# Altium schematic sheet TIDA-010967_Decoupling_caps.SchDoc: DECOUPLING_CAPS
size 431 x 279 mm; Date: Not shown in title block; ApprovedBy: Not shown in title block; CheckedBy: Not shown in title block; Author: Not shown in title block; CompanyName: Not shown in title block; DrawnBy: Justin Yin; Engineer: Not shown in title block; Organization: Not shown in title block; Address1: Not shown in title block; Address2: Not shown in title block; Address3: Not shown in title block; Address4: Not shown in title block; DocumentNumber: 6; Revision: Use project parameter SCH_Rev; SheetNumber: 6; SheetTotal: 8; PageSetup: Record=PageOptions|CenterHorizontal=True|CenterVertical=True|PrintScale=1.00|XCorrection=1.00|YCorrection=1.00|PrintKind=0|BorderSize=5000000|LeftOffset=0|BottomOffset=0|Orientation=2|PaperLength=1000|PaperWidth=1000|Scale=100|PaperSource=15|PrintQuality=600|MediaType=1|DitherType=10|PaperKind=Letter|PrintScaleMode=1; CurrentTime: Not shown in title block; CurrentDate: Not shown in title block; Time: Not shown in title block; DocumentFullPathAndName: Not shown in title block; DocumentName: Not shown in title block; ModifiedDate: Not shown in title block; ImagePath: Not shown in title block
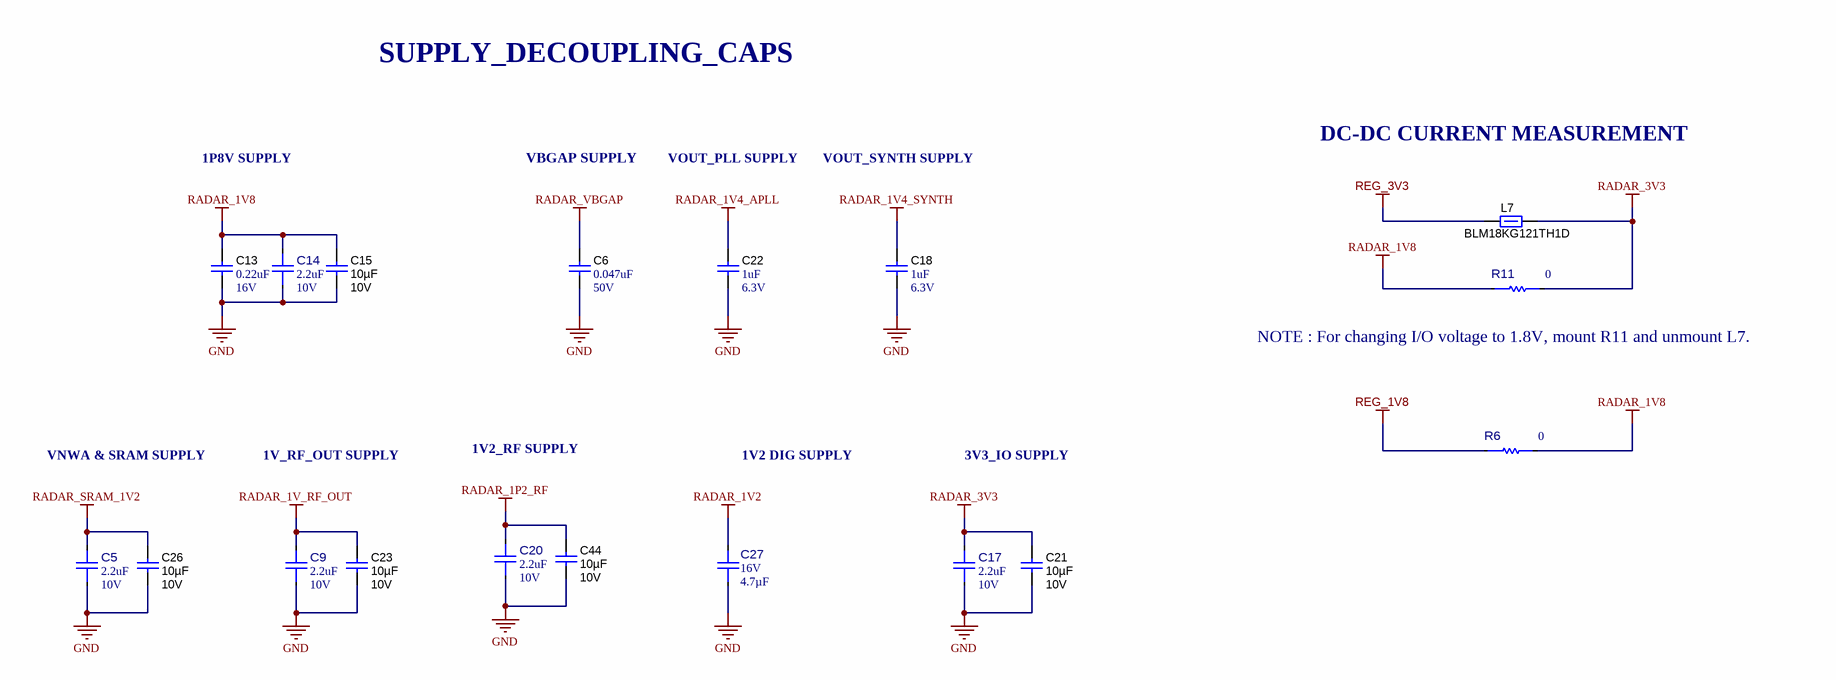
[diagram p0: TIDA-010967_Decoupling_caps.SchDoc]

## Parts
C5  ValueDisplayed: 2.2uF  VDC_V: 10V  [FP-GRM155R61A225ME01D_0402-MFG]  (hidden comment: GRM155R61A225ME01D)
C6  VDC_V: 50V  ValueDisplayed: 0.047uF  [0402L]  (hidden comment: C1005X7R1H473K050BB)
C9  ValueDisplayed: 2.2uF  VDC_V: 10V  [FP-GRM155R61A225ME01D_0402-MFG]  (hidden comment: GRM155R61A225ME01D)
C13  VDC_V: 16V  ValueDisplayed: 0.22uF  [0402L]  (hidden comment: GRM155R71C224KA12D)
C14  ValueDisplayed: 2.2uF  VDC_V: 10V  [FP-GRM155R61A225ME01D_0402-MFG]  (hidden comment: GRM155R61A225ME01D)
C15  Value2: 10V  Cap_F: 10µF  [0603L]  (hidden comment: GRM188Z71A106MA73D)
C17  ValueDisplayed: 2.2uF  VDC_V: 10V  [FP-GRM155R61A225ME01D_0402-MFG]  (hidden comment: GRM155R61A225ME01D)
C18  VDC_V: 6.3V  ValueDisplayed: 1uF  [0402S]  (hidden comment: GRM155R70J105KA12D)
C20  ValueDisplayed: 2.2uF  VDC_V: 10V  [FP-GRM155R61A225ME01D_0402-MFG]  (hidden comment: GRM155R61A225ME01D)
C21  Value2: 10V  Cap_F: 10µF  [0603L]  (hidden comment: GRM188Z71A106MA73D)
C22  VDC_V: 6.3V  ValueDisplayed: 1uF  [0402S]  (hidden comment: GRM155R70J105KA12D)
C23  Value2: 10V  Cap_F: 10µF  [0603L]  (hidden comment: GRM188Z71A106MA73D)
C26  Value2: 10V  Cap_F: 10µF  [0603L]  (hidden comment: GRM188Z71A106MA73D)
C27  VDC_V: 16V  Cap_F: 4.7µF  [FP-GCJ21BR71C475KA01L_0805-MFG]  (hidden comment: GCJ21BR71C475KA01L)
C44  Value2: 10V  Cap_F: 10µF  [0603L]  (hidden comment: GRM188Z71A106MA73D)
L7  BLM18KG121TH1D  [0603L]
R6  Res_ohm: 0  [FP-ERJ-3GEY0R00V_0603-MFG]  (hidden comment: ERJ-3GEY0R00V)
R11  Res_ohm: 0  [FP-ERJ-3GEY0R00V_0603-MFG]  (hidden comment: ERJ-3GEY0R00V)

## Nets
GND: C5.1 C6.2 C9.1 C13.2 C14.1 C15.2 C17.1 C18.2 C20.1 C21.2 C22.2 C23.2 C26.2 C27.1 C44.2
RADAR_1P2_RF: C20.2 C44.1
RADAR_1V2: C27.2
RADAR_1V4_APLL: C22.1
RADAR_1V4_SYNTH: C18.1
RADAR_1V8: C13.1 C14.2 C15.1 R6.2 R11.1
RADAR_1V_RF_OUT: C9.2 C23.1
RADAR_3V3: C17.2 C21.1 L7.2 R11.2
RADAR_SRAM_1V2: C5.2 C26.1
RADAR_VBGAP: C6.1
REG_1V8: R6.1
REG_3V3: L7.1

## Notes on the sheet
- SUPPLY_DECOUPLING_CAPS
- DC-DC CURRENT MEASUREMENT
- 1P8V SUPPLY
- VBGAP SUPPLY
- VOUT_PLL SUPPLY
- VOUT_SYNTH SUPPLY
- (near R11) NOTE : For changing I/O voltage to 1.8V, mount R11 and unmount L7.
- VNWA & SRAM SUPPLY
- 1V_RF_OUT SUPPLY
- 1V2_RF SUPPLY
- 1V2 DIG SUPPLY
- 3V3_IO SUPPLY
- Drawn By:
- SVN Rev:
- Number:
- TID #:
- Orderable:
- Rev:
- Sheet Title:
- File:
- Project Title:
- Designed for:
- Assembly Variant:
- Mod. Date:
- Sheet:
- Size:
- of
- B
- http://www.ti.com
- Texas Instruments and/or its licensors do not warrant the accuracy or completeness of this specification or any information contained therein. Texas Instruments and/or its licensors do not warrant that this design will meet the specifications, will be suitable for your application or fit for any particular purpose, or will operate in an implementation. Texas Instruments and/or its licensors do not warrant that the design is production worthy. You should completely validate and test your design implementation to confirm the system functionality for your application.
- Engineer:
- Contact:
- © Texas Instruments

## Library data of the parts
C5 C9 C14 C17 C20 = CMP-0097887-1: Chip Multilayer Ceramic Capacitors for General Purpose, 0402, 2.2uF, X5R, 15%, 20%, 10V; Manufacturer: Murata; SizeZ_mm: 0.55mm; Value: 2.2µF; AEC Qualified: No; ComponentLink1URL: https://www.murata.com/en-us/products/productdetail?partno=GRM155R61A225ME01%23; PartNumber: GRM155R61A225ME01D; RoHS: TRUE; Temperature Characteristic: X5R; datasheet: https://www.murata.com/en-us/products/productdetail?partno=GRM155R61A225ME01%23; PackageReference: 0402; Part Number: GRM155R61A225ME01D; Lead Free: Yes; Operating Temperature Range: -55°C to +85°C; ComponentLink1Description: Datasheet; Tolerance_%: 20%; helpURL: https://upverter.com/upn/revision/9c1060debce10243/; Datasheet Path: datasheets/Cap-GRM155R61A225ME01D.pdf; TempCo: 15%; Cap_F: 2.2µF
C6 = CMP-0006298-2: CAP, CERM, 0.047 uF, 50 V, +/- 10%, X7R, 0402; Manufacturer: TDK; TaMin_C: -55°C; ESR_ohm: 0.06407; Polarized: N; SizeAreaWB_mm2: 3; Value1: 0.06407 ohm; U/M: EA; SizeZ_mm: 0.6; SizeX_mm: 1; SizeY_mm: 0.5; Cap_Case: 0402; Cap_F: 47nF; IRMS_A: 6.46122dA; AEC Category: Q200; TaMax_C: 125°C; Supplier Part Number 2: 04X3233; Publisher: Texas Instruments; Supplier 2: Newark; Supplier Part Number 3: 810-C1005X7R1H473K; TempCo: X7R; Supplier 3: Mouser; Published: 2008-06-19; RoHS: Y; MountType: SMT; Value: 0.047uF; Supplier 1: Digi-Key; PackageReference: 0402; Tolerance_%: 10%; Value2: 50V; SizeArea_mm2: 0.5; CompType: Capacitor; LatestRevisionDate: 2017-03-09; PartNumber: C1005X7R1H473K050BB; AEC Qualified: N; ComponentLink1Description: Datasheet link; AEC Grade: N/A; Supplier Part Number 1: 445-7336-1-ND; Technology: Ceramic; ComponentLink1URL: https://product.tdk.com/en/search/capacitor/ceramic/mlcc/info?part_no=C1005X7R1H473K050BB
C13 = CMP-0006648-2: CAP, CERM, 0.22 uF, 16 V, +/- 10%, X7R, 0402; Manufacturer: MuRata; TaMin_C: -55°C; Polarized: N; SizeAreaWB_mm2: 3; Value1: Unknown; U/M: EA; Value: 0.22uF; TaMax_C: 125°C; SizeZ_mm: 0.6; SizeX_mm: 1; SizeY_mm: 0.5; Cap_Case: 0402; Cap_F: 220nF; AEC Category: Q200; Supplier Part Number 2: 81-GRM155R71C224KA2D; Publisher: Texas Instruments; Supplier 2: Mouser; TempCo: X7R; Published: 2008-06-19; RoHS: Y; MountType: SMT; Supplier 1: Digi-Key; PackageReference: 0402; Tolerance_%: 10%; Value2: 16V; SizeArea_mm2: 0.5; CompType: Capacitor; LatestRevisionDate: 2017-03-09; PartNumber: GRM155R71C224KA12D; AEC Qualified: ?; ComponentLink1Description: Datasheet link; Supplier Part Number 1: 490-5418-1-ND; Technology: Ceramic; ComponentLink1URL: http://search.murata.co.jp/Ceramy/PnsearchViewAction.do?HnOFG=ON&HnNFG=ON&SEL_CNT=50&sLang=en&sKey=GRM155R71C224KA12D&x=9&y=9&search=startwith
C15 C21 C23 C26 C44 = CMP-0007497-5: CAP, CERM, 10 uF, 10 V, +/- 20%, X7R, 0603; Manufacturer: MuRata; TaMin_C: -55°C; Polarized: N; SizeAreaWB_mm2: 4.68; Value1: Unknown; U/M: EA; Value: 10uF; TaMax_C: 125°C; SizeZ_mm: 1; SizeX_mm: 1.6; SizeY_mm: 0.8; Cap_Case: 0603; SizeArea_mm2: 1.28; AEC Category: Q200; Publisher: Texas Instruments; TempCo: X7R; Published: 2008-06-19; RoHS: Y; MountType: SMT; Supplier 1: Mouser; PackageReference: 0603; Tolerance_%: 20%; CompType: Capacitor; LatestRevisionDate: 2017-03-09; PartNumber: GRM188Z71A106MA73D; AEC Qualified: N; VDC_V: 10V; ComponentLink1Description: Datasheet link; AEC Grade: N/A; Supplier Part Number 1: 81-GRM188Z71A106MA3D; Technology: Ceramic; ValueDisplayed: 10uF; ComponentLink1URL: http://psearch.en.murata.com/capacitor/product/GRM188Z71A106MA73%23.pdf
C18 C22 = CMP-0064947-2: CAP, CERM, 1 uF, 6.3 V,+/- 10%, X7R, 0402; Manufacturer: MuRata; TaMin_C: -55°C; Polarized: N; SizeAreaWB_mm2: 3; Value1: Unknown; U/M: EA; Value: 1uF; TaMax_C: 125°C; SizeZ_mm: 0.6; SizeX_mm: 1; SizeY_mm: 0.5; Cap_Case: 0402; Cap_F: 1µF; AEC Category: Q200; Supplier Part Number 2: 81-GRM155R70J105KA2D; Publisher: Texas Instruments; Supplier 2: Mouser; Supplier Part Number 3: 2688505RL; TempCo: X7R; Supplier 3: Farnell; Published: 2008-06-19; RoHS: Y; MountType: SMT; Supplier 1: Digi-Key; PackageReference: 0402; Tolerance_%: 10%; Value2: 6.3V; SizeArea_mm2: 0.5; CompType: Capacitor; LatestRevisionDate: 2017-06-05; PartNumber: GRM155R70J105KA12D; AEC Qualified: N; ComponentLink1Description: Datasheet link; AEC Grade: N/A; Supplier Part Number 1: 490-10024-1-ND; Technology: Ceramic; ComponentLink1URL: http://search.murata.co.jp/Ceramy/image/img/A01X/G101/ENG/GRM155R70J105KA12-01.pdf
C27 = CMP-0094778-1: Multilayer Ceramic Capacitors MLCC - SMD/SMT 0805 4.7uF 10%, 16VDC,  X7R 15%; Manufacturer: Murata; AEC Qualified: Yes; Value: 4.7µF; AEC Grade: Grade 1; SizeZ_mm: 1.45mm; helpURL: https://upverter.com/upn/revision/6981e148239812b6/; Lead Free: Yes; ComponentLink1URL: https://www.murata.com/en-us/products/productdetail?partno=GCJ21BR71C475KA01%23; RoHS: TRUE; Part Number: GCJ21BR71C475KA01L; PartNumber: GCJ21BR71C475KA01L; TempCo: 15%; Datasheet Path: datasheets/Cap-GCJ21BR71C475KA01L.pdf; Temperature Characteristic: X7R; ComponentLink1Description: Datasheet; Operating Temperature Range: -55°C to +125°C; datasheet: https://www.murata.com/en-us/products/productdetail?partno=GCJ21BR71C475KA01%23; Tolerance_%: 10%; ValueDisplayed: 4.7uF; PackageReference: 0805
L7 = CMP-0077879-2: Ferrite Bead, 120 ohm @ 100 MHz, 1.9 A, 0603; Manufacturer: MuRata; ZTyp@100MHz_Ohm: 120; SizeAreaWB_mm2: 4.68; DCR_ohm: 0.04; Value1: 0.04 ohm; Value: 120 ohm; Imax_A: 1.9A; SizeZ_mm: 1.0; SizeX_mm: 1.6; SizeY_mm: 0.8; SizeArea_mm2: 1.28; ComponentLink1URL: http://www.murata.com/en-global/products/productdata/8796737273886/QNFA9101.pdf; Supplier Part Number 2: 81-BLM18KG121TH1D; Supplier 2: Mouser; RoHS: Y; MountType: SMT; Supplier 1: Digi-Key; PackageReference: 0603; Value2: 1.9A; CompType: Ferrite Bead; PartNumber: BLM18KG121TH1D; ComponentLink1Description: Datasheet link; Supplier Part Number 1: 490-13261-1-ND; ValueDisplayed: 120 ohm
R6 R11 = CMP-0089143-1: 0 Ohms Jumper 0.1W, 1/10W Chip Resistor 0603 (1608 Metric) Automotive AEC-Q200 Thick Film; Manufacturer: Panasonic; SizeZ_mm: 0.55mm; AEC Grade: Grade 0; VDC_V: 75V; TempCo: -100/+600ppm/°C; AEC Qualified: Yes; Power_W: 100mW; Tolerance_%: 5%; Operating Temperature Range: -55°C to +155°C; Device Class L1: Passive Components; Lead Free: Yes; Supplier 2: Mouser; Part Number: ERJ-3GEY0R00V; ComponentLink1URL: https://industrial.panasonic.com/cdbs/www-data/pdf/RDA0000/AOA0000C301.pdf; Datasheet Path: datasheets/Res-ERJ-3GEY0R00V.pdf; Supplier Part Number 1: P0.0GCT-ND; Supplier Part Number 2: 667-ERJ-3GEY0R00V; Device Class L3: Chip SMD Resistors; Supplier 1: Digikey; Digikey Part Number: P0.0GCT-ND; RoHS: TRUE; Series: ERJ; PartNumber: ERJ-3GEY0R00V; datasheet: https://industrial.panasonic.com/cdbs/www-data/pdf/RDA0000/AOA0000C301.pdf; Mouser Description: Resistor, Chip Thick Film, 0 Ohm, 0.1w, Resistor, Chip Thick Film, 0 Ohm, 0.1w, 5%; ComponentLink1Description: Datasheet; helpURL: https://upverter.com/upn/revision/655dc946655e5dbc/; Device Class L2: Resistors; Digikey Description: RES SMD 0 OHM JUMPER 1/10W 0603; Technology: Thick Film; Mouser Part Number: 667-ERJ-3GEY0R00V; PackageReference: 0603